# Altium schematic sheet CellSelectModule.SchDoc
size A4; SheetNumber: 3; SheetTotal: 8
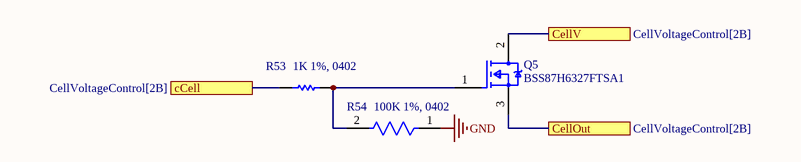
[diagram p0: CellSelectModule.SchDoc]

## Parts
Q5  BSS87H6327FTSA1  [FP-PG-SOT89-4-MFG]
R53  1K 1%, 0402  [RESC1005X40X25NL05T05]
R54  100K 1%, 0402  [FP-ERJ2RK-IPC_C]

## Ports
cCell (see CellVoltageControl[2B]), CellOut (see CellVoltageControl[2B]), CellV (see CellVoltageControl[2B])

## Nets
GND: R54.1
cCell: R53.2 ; port cCell
CellOut: Q5.3(Source) ; port CellOut
CellV: Q5.2(Drain) ; port CellV
NetQ5_1: Q5.1(Gate) R53.1 R54.2

## Library data of the parts
Q5 = CMP-32901-001322-1: MOSFET N-CH 240V 260MA SOT89-4; Input Capacitance: 97pF; Drain to Source Resistance: 3.9R; Rise Time: 3.5ns; Rds On Max: 6R; Fall Time: 27.3ns; Turn-On Delay Time: 3.7ns; Number of Elements: 1; Power Dissipation: 1W; Element Configuration: Single; Gate to Source Voltage (Vgs): 20V; Polarity: N-CHANNEL; Turn-Off Delay Time: 17.6ns; Case/Package: SOT-89; Max Dual Supply Voltage: 240V; Drain to Source Voltage (Vdss): 240V; Lead Free: Lead Free; Package Quantity: 1000; Halogen Free: Not Halogen Free; RoHS Compliant: Yes; Width: 2.5mm; Length: 4.5mm; Mount: Surface Mount; Packaging: Tape and Reel; Max Power Dissipation: 1W; Height: 1.5mm; Max Operating Temperature: 150°C; Series: SIPMOS®; Drain to Source Breakdown Voltage: 240V; Min Operating Temperature: -55°C; Number of Pins: 3; Continuous Drain Current (ID): 260mA
R53 = CMP-1011-00510-4: Chip Resistor, 1 KOhm, +/- 1%, 100 mW, -55 to 155 degC, 0402 (1005 Metric), RoHS, Tape and Reel; PartNumber: ERJ-2RKF1001X; Manufacturer: Basic Passives; Voltage Rating: 50 V; Case\/Package: 0402; Resistance: 1 KOhm; Power Rating: 100 mW; DatasheetVersion: 04/2015; Radiation Hardening: No; Pins: 2; Height: 0.35 mm; RoHSCompliant: true; Case Code (Imperial): 0402; ComponentLink2Description: Datasheet; ComponentLink1Description: Manufacturer URL; PackageReference: 0402; Mount: Surface Mount; Package Quantity: 10000; Tolerance: 1%; ComponentLink1URL: http://www.panasonic.com/; PackageDescription: 2-Pin Surface Mount Device, Body 1 x 0.5 mm; Mounting Technology: Surface Mount; Case Code (Metric): 1005; ComponentLink2URL: http://industrial.panasonic.com/cdbs/www-data/pdf/RDA0000/AOA0000C86.pdf; REACH SVHC: Yes; Packaging: Tape and Reel; Max Operating Temperature: 155 degC; Min Operating Temperature: -55 degC; Width: 0.5 mm; Length: 1 mm
R54 = CMP-2002-00608-4: RES SMD 100K OHM 1% 1/10W 0402; Resistance: 100kR; Voltage Rating (DC): 50V; Power Rating: 100mW; Temperature Coefficient: 100ppm/°C; Case/Package: 0402; Length: 1mm; Package Quantity: 1; Radiation Hardening: No; Case Code (Metric): 1005; Contact Plating: Tin; Mount: Surface Mount; Depth: 0.5mm; Max Operating Temperature: 155°C; Lead Free: Lead Free; Width: 0.5mm; Composition: Thick Film; Case Code (Imperial): 0402; Tolerance: 1%; Termination: SMD/SMT; Number of Pins: 2; Height: 0.35mm; Voltage Rating: 50V; Military Standard: Not; REACH SVHC: No SVHC; Packaging: Tape and Reel; Min Operating Temperature: -55°C; Max Power Dissipation: 100mW; Features: Automotive AEC-Q200; Number of Terminations: 2